# Altium schematic sheet RADC-Peripherals-S05-V00.SchDoc
size A3; SheetNumber: 6; SheetTotal: 7
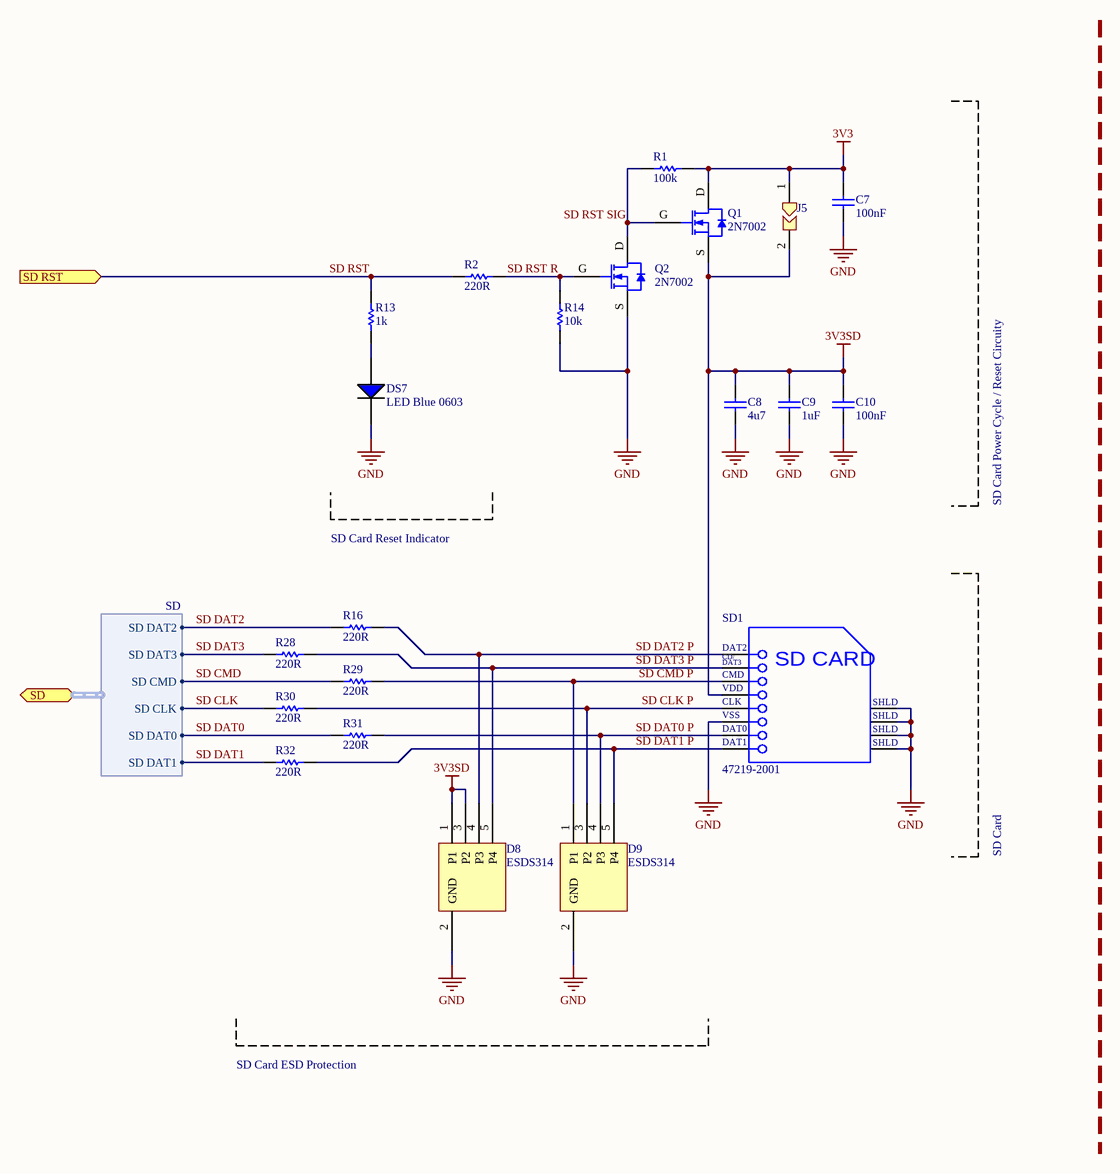
[diagram p0: RADC-Peripherals-S05-V00.SchDoc]

## Parts
C7  100nF  [Cap_Ceramic_0603]
C8  4u7  [Cap_Ceramic_0603]
C9  1uF  [Cap_Ceramic_0603]
C10  100nF  [Cap_Ceramic_0603]
D8  ESDS314  [SOT-23-5]
D9  ESDS314  [SOT-23-5]
DS7  LED Blue 0603  [LED BLUE 0603]
J5  Jumper 2Way Solderable  [Jumper_2Way_Solderable]  (value not drawn)
Q1  2N7002  [SOT23-3]
Q2  2N7002  [SOT23-3]
R1  100k  [Res_ThinFilm_0603]
R2  220R  [Res_ThinFilm_0603]
R13  1k  [Res_ThinFilm_0603]
R14  10k  [Res_ThinFilm_0603]
R16  220R  [Res_ThinFilm_0603]
R28  220R  [Res_ThinFilm_0603]
R29  220R  [Res_ThinFilm_0603]
R30  220R  [Res_ThinFilm_0603]
R31  220R  [Res_ThinFilm_0603]
R32  220R  [Res_ThinFilm_0603]
SD1  47219-2001  [47219-2001]

## Ports
SD (bidir, harness SD), SD RST (in)

## Harnesses
SD: SD DAT2, SD DAT3, SD CMD, SD CLK, SD DAT0, SD DAT1

## Nets
3V3: C7.2 J5.1 Q1.D R1.1
3V3SD: C8.2 C9.2 C10.2 D8.1(P1) D8.3(P2) J5.2 Q1.S SD1.4(VDD)
GND: C7.1 C8.1 C9.1 C10.1 D8.2(GND) D9.2(GND) DS7.2(C) Q2.S R14.1 SD1.6(VSS) SD1.9(SHLD) SD1.10(SHLD) SD1.11(SHLD) SD1.12(SHLD)
SD CLK: R30.1 ; port SD.SD CLK
SD CLK P: D9.3(P2) R30.2 SD1.5(CLK)
SD CMD: R29.1 ; port SD.SD CMD
SD CMD P: D9.1(P1) R29.2 SD1.3(CMD)
SD DAT0: R31.1 ; port SD.SD DAT0
SD DAT0 P: D9.4(P3) R31.2 SD1.7(DAT0)
SD DAT1: R32.1 ; port SD.SD DAT1
SD DAT1 P: D9.5(P4) R32.2 SD1.8(DAT1)
SD DAT2: R16.1 ; port SD.SD DAT2
SD DAT2 P: D8.4(P3) R16.2 SD1.1(DAT2)
SD DAT3: R28.1 ; port SD.SD DAT3
SD DAT3 P: D8.5(P4) R28.2 SD1.2(CD/DAT3)
SD RST: R2.1 R13.2 ; port SD RST
SD RST R: Q2.G R2.2 R14.2
SD RST SIG: Q1.G Q2.D R1.2
NetDS7_1: DS7.1(A) R13.1

## Notes on the sheet
- SD Card Power Cycle / Reset Circuity
- SD Card Reset Indicator
- SD Card
- SD Card ESD Protection
- Revision History:
- Sheet Title:
- Rev
- Date
- Description
- Project:
- Size:
- Drawn By:
- A3
- Number:
- Revision:
- Sheet
- Version:
- of
- QUT Motorsport
- O-120, Gardens Point
- 2 George Street
- Brisbane, QLD 4000
- Australia
- Print Date:
- Print Time:
- File Name:
- (in symbol 47219-2001) CD/; DAT3; SD CARD

## Library data of the parts
C7 C10 = 100nF 50V 5% X7R 0603: Capacitor, Ceramic, SMD, 100nF, 50V, 5%, X7R, 0603
C8 = 4u7 50V 5% X7R 0603: Capacitor, Ceramic, SMD, 4u7, 50V, 5%, X7R, 0603
C9 = 1uF 25V 5% X7R 0603: Capacitor, Ceramic, SMD, 1uF, 25V, 5%, X7R, 0603
D8 D9 = ESDS314: 6.5V (Typ) Clamp 25A (8/20µs) Ipp Tvs Diode Surface Mount SOT-23-5
J5 = Jumper 2Way Vert Solderable
R1 = 100k 5%, 0603: Resistor, SMD, 100k, 0.1W, 5%, 0603
R2 R16 R28-R32 = 220R 5% 0603: Resistor, SMD, 220R, 0.1W, 5%, 0603
R13 = 1k 5% 0603: Resistor, SMD, 1k, 0.1W, 5%, 0603
R14 = 10k 5% 0603: Resistor, SMD, 10k, 0.1W, 5%, 0603
SD1 = 47219-2001: MicroSD Card Connector, Hinge Type, -40 to 85 degC, 8-Pin SMD, RoHS, Tape and Reel